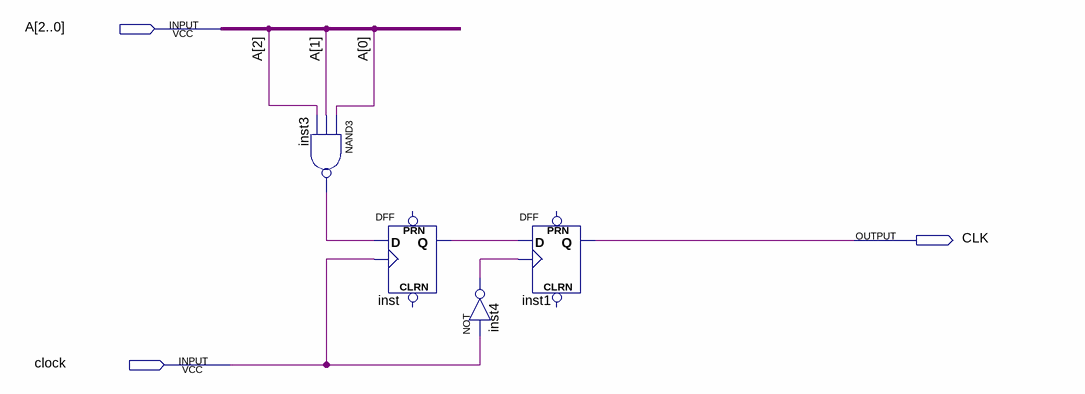
[diagram p0: schematic sheet]
// Quartus schematic Clock.bdf as structural Verilog: 4 symbols, 3 pins
module Clock (
  input  [2:0] A,
  input  clock,
  output CLK
);

  wire inst3_out, inst4_out, inst_q;

  nand inst3 (inst3_out, A[0], A[1], A[2]);
  DFF inst (.CLK(clock), .D(inst3_out), .Q(inst_q));  // open: CLRN, PRN
  not inst4 (inst4_out, clock);
  DFF inst1 (.CLK(inst4_out), .D(inst_q), .Q(CLK));  // open: CLRN, PRN
endmodule
